# Altium project Control_Module_V1.PrjPcb
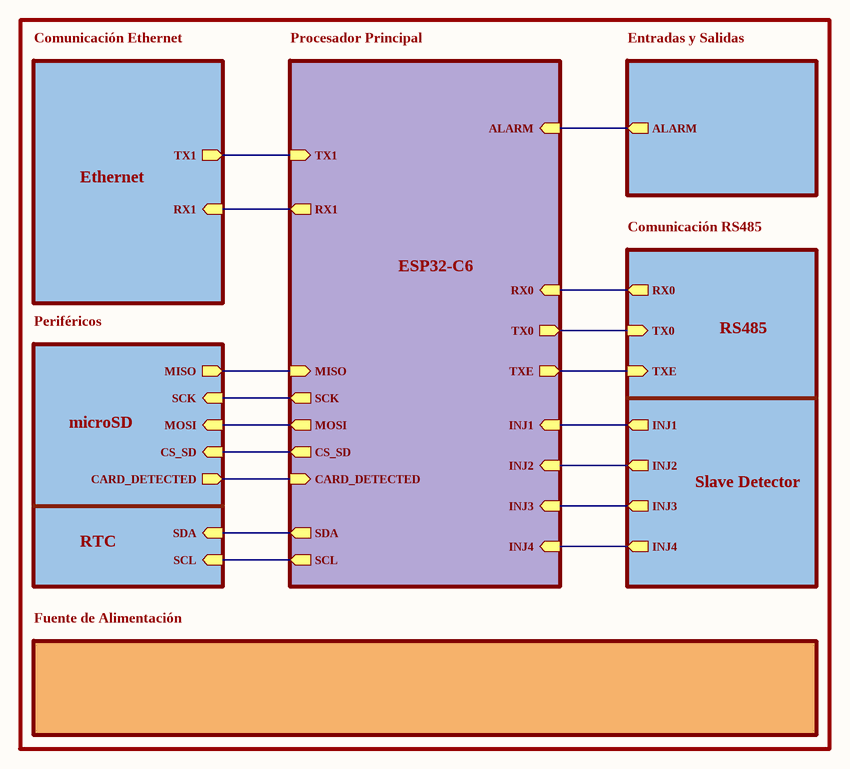
[diagram p0: Control_Module_MAIN.SchDoc]
7 sheets, 113 parts. Net scope: hierarchical (ports join the sheet entries above them; power ports are global).
Board files: Control_Module_PCB_V1.PcbDoc, Control_Module_Panel.PcbDoc
Sheets:
  Control_Module_MAIN.SchDoc
    Comunicación Ethernet = Control_Module_ETH.SchDoc
    Procesador Principal = Control_Module_CPU.SchDoc
    Comunicación RS485 = Control_Module_RS485.SchDoc
    Fuente de Alimentación = Control_Module_PSU.SchDoc
    Periféricos = Control_Module_PER.SchDoc
    Entradas y Salidas = Control_Module_IO.SchDoc

## Sheet Control_Module_MAIN.SchDoc: Módulo de Control - Vista General
size A4; Author: Martin C.A. Yunis; CompanyName: Sistema de Control de Acceso; Revision: V1; SheetNumber: 1; SheetTotal: 7

### Sub-sheets
Comunicación Ethernet = Control_Module_ETH: TX1 (out), RX1 (in)
Comunicación RS485 = Control_Module_RS485: RX0 (out), TX0 (in), TXE (in), INJ1 (out), INJ2 (out), INJ3 (out), INJ4 (out)
Entradas y Salidas = Control_Module_IO: ALARM (out)
Fuente de Alimentación = Control_Module_PSU: no entries
Periféricos = Control_Module_PER: MISO (out), SCK (in), MOSI (in), CS_SD (in), CARD_DETECTED (out), SDA (in), SCL (in)
Procesador Principal = Control_Module_CPU: MISO (in), SCK (out), MOSI (out), CS_SD (out), CARD_DETECTED (in), SDA (out), SCL (out), ALARM (in), RX1 (out), RX0 (in), TX0 (out), TXE (out), INJ1 (in), TX1 (in), INJ2 (in), INJ3 (in), INJ4 (in)

### Nets
CD: sheet Procesador Principal/CARD_DETECTED, sheet Periféricos/CARD_DETECTED
CS_SD: sheet Procesador Principal/CS_SD, sheet Periféricos/CS_SD
INJ1: sheet Procesador Principal/INJ1, sheet Comunicación RS485/INJ1
INJ2: sheet Procesador Principal/INJ2, sheet Comunicación RS485/INJ2
INJ3: sheet Procesador Principal/INJ3, sheet Comunicación RS485/INJ3
INJ4: sheet Procesador Principal/INJ4, sheet Comunicación RS485/INJ4
MISO: sheet Procesador Principal/MISO, sheet Periféricos/MISO
MOSI: sheet Procesador Principal/MOSI, sheet Periféricos/MOSI
RX0: sheet Procesador Principal/RX0, sheet Comunicación RS485/RX0
RX1: sheet Comunicación Ethernet/RX1, sheet Procesador Principal/RX1
SCK: sheet Procesador Principal/SCK, sheet Periféricos/SCK
SCL: sheet Procesador Principal/SCL, sheet Periféricos/SCL
SDA: sheet Procesador Principal/SDA, sheet Periféricos/SDA
TX0: sheet Procesador Principal/TX0, sheet Comunicación RS485/TX0
TX1: sheet Comunicación Ethernet/TX1, sheet Procesador Principal/TX1
TXE: sheet Procesador Principal/TXE, sheet Comunicación RS485/TXE
V_Alarm: sheet Procesador Principal/ALARM, sheet Entradas y Salidas/ALARM

### Notes on the sheet
- Ethernet
- ESP32-C6
- RS485
- microSD
- Slave Detector
- RTC
- Title:
- Size:
- Author:
- A4
- Sheet
- of
- Revision:
- File:
- Date:

## Sheet Control_Module_ETH.SchDoc: Módulo de Control - Ethernet
size A4; Author: Martin C.A. Yunis; CompanyName: Sistema de Control de Acceso; Revision: V1; SheetNumber: 2; SheetTotal: 7
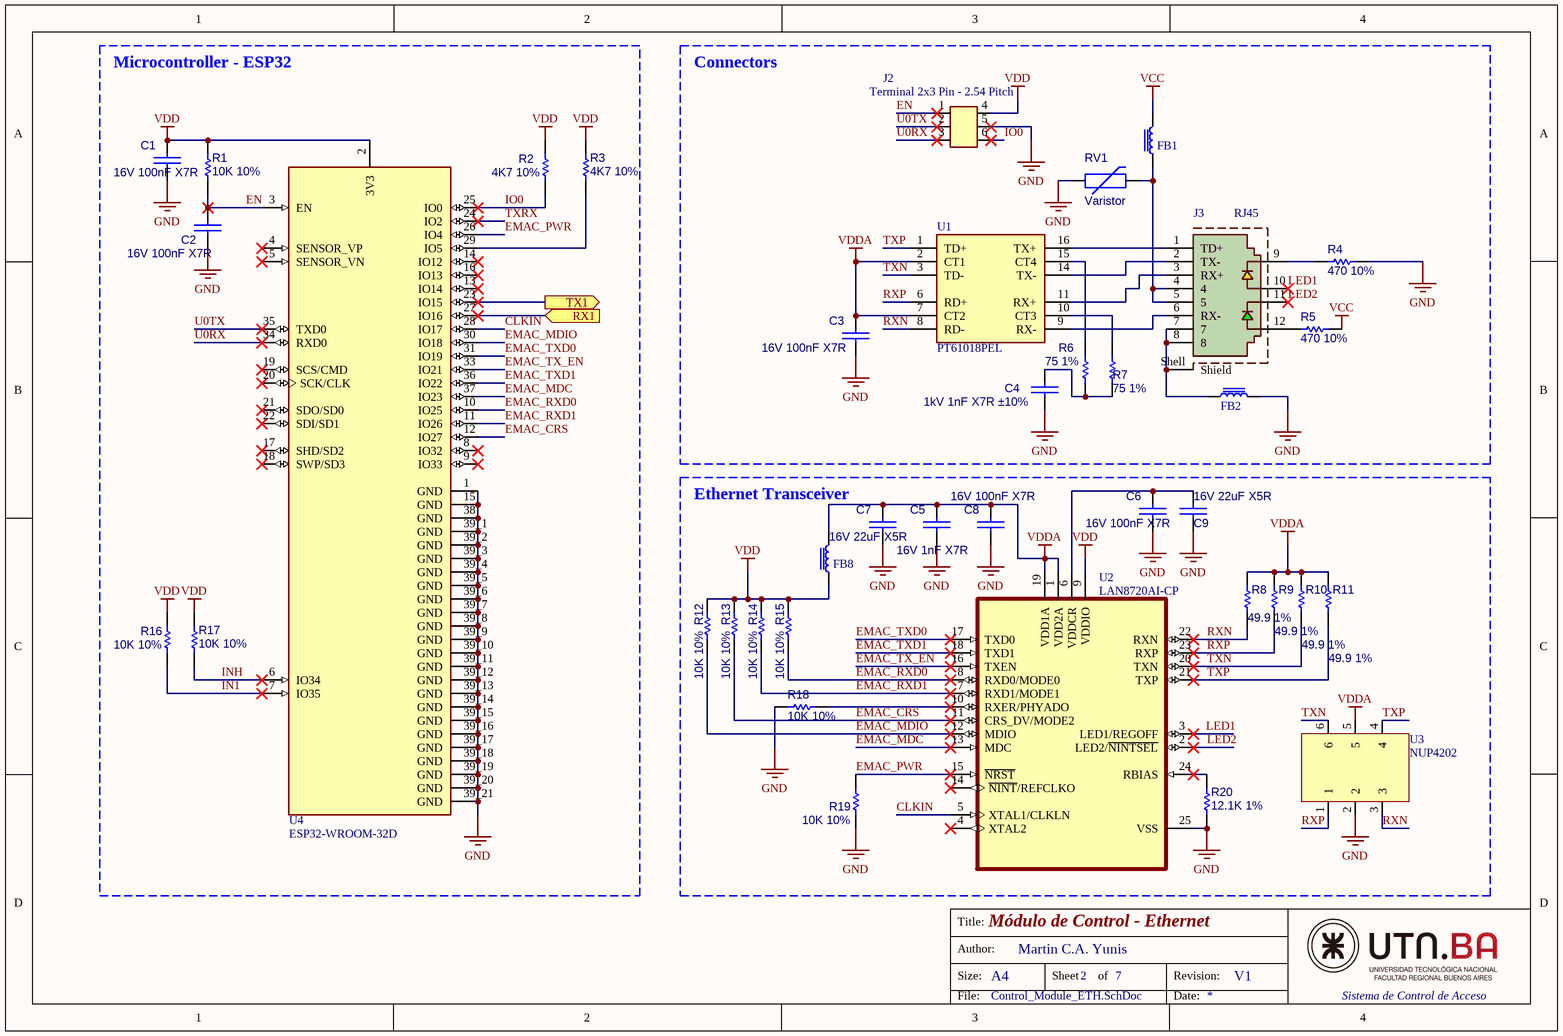
[diagram p1: Control_Module_ETH.SchDoc]

### Parts
C1  16V 100nF X7R  [CAP0402]
C2  16V 100nF X7R  [CAP0402]
C3  16V 100nF X7R  [CAP0402]
C4  1kV 1nF X7R ±10%  [CAP_1210]
C5  16V 1nF X7R  [CAP0402]
C6  16V 100nF X7R  [CAP0402]
C7  16V 22uF X5R  [CAP_1210]
C8  16V 100nF X7R  [CAP0402]
C9  16V 22uF X5R  [CAP_1210]
FB1  Choke 450mΩ ±25%  [CHOKE0603]  (value not drawn)
FB2  Choke 450mΩ ±25%  [CHOKE0603]  (value not drawn)
FB8  Choke  [CHOKE0603]  (value not drawn)
J2  Terminal 2x3 Pin - 2.54 Pitch  [2]
J3  RJ45  [TE_6116173-4]
R1  10K 10%  [RES0402]
R2  4K7 10%  [RES0402]
R3  4K7 10%  [RES0402]
R4  470 10%  [RES0402]
R5  470 10%  [RES0402]
R6  75 1%  [RES0402]
R7  75 1%  [RES0402]
R8  49.9 1%  [RES0402]
R9  49.9 1%  [RES0402]
R10  49.9 1%  [RES0402]
R11  49.9 1%  [RES0402]
R12  10K 10%  [RES0402]
R13  10K 10%  [RES0402]
R14  10K 10%  [RES0402]
R15  10K 10%  [RES0402]
R16  10K 10%  [RES0402]
R17  10K 10%  [RES0402]
R18  10K 10%  [RES0402]
R19  10K 10%  [RES0402]
R20  12.1K 1%  [RES0402]
RV1  Varistor  [RES0805]
U1  PT61018PEL  [XFMR_PT61018PEL]
U2  LAN8720AI-CP  [QFN50P400X400X100-25N]
U3  NUP4202  [SOT65P210X110-6N]
U4  ESP32-WROOM-32D  [XCVR_ESP32-WROOM-32U]

### Blocks framed on the sheet
Microcontroller - ESP32: C1 C2 R1-R3 R16 R17 U4
Connectors: C3 C4 FB1 FB2 J2 J3 R4-R7 RV1 U1
Ethernet Transceiver: C5-C9 FB8 R8-R15 R18-R20 U2 U3

### Ports
RX1 (in, see Control_Module_MAIN[2B], Control_Module_CPU[1B]), TX1 (out, see Control_Module_MAIN[2A], Control_Module_CPU[1C])

### Nets
GND: C1.2 C2.2 C3.2 C4.2 C5.2 C6.2 C7.2 C8.2 C9.2 FB2.2 J2.5 R4.2 R18.1 R19.2 R20.2 RV1.1 U2.25(VSS) U3.2 U4.1(GND) U4.15(GND) U4.38(GND) U4.39_1(GND) U4.39_2(GND) U4.39_3(GND) U4.39_4(GND) U4.39_5(GND) U4.39_6(GND) U4.39_7(GND) U4.39_8(GND) U4.39_9(GND) U4.39_10(GND) U4.39_11(GND) U4.39_12(GND) U4.39_13(GND) U4.39_14(GND) U4.39_15(GND) U4.39_16(GND) U4.39_17(GND) U4.39_18(GND) U4.39_19(GND) U4.39_20(GND) U4.39_21(GND)
VCC: FB1.2 R5.2
VDD: C1.1 FB8.1 J2.4 R1.1 R2.1 R3.1 R12.1 R13.1 R14.1 R15.1 R16.1 R17.1 U2.9(VDDIO) U4.2(3V3)
VDDA: C3.1 C5.1 C7.1 C8.1 FB8.2 R8.1 R9.1 R10.1 R11.1 U1.2(CT1) U1.7(CT2) U2.1(VDD2A) U2.19(VDD1A) U3.5
CLKIN: U2.5(XTAL1/CLKLN) U4.28(IO17)
EMAC_CRS: R13.2 U2.11(CRS_DV/MODE2) U4.12(IO27)
EMAC_MDC: U2.13(MDC) U4.37(IO23)
EMAC_MDIO: R12.2 U2.12(MDIO) U4.30(IO18)
EMAC_PWR: R19.1 U2.15(~{NRST}) U4.26(IO4)
EMAC_RXD0: R15.2 U2.8(RXD0/MODE0) U4.10(IO25)
EMAC_RXD1: R14.2 U2.7(RXD1/MODE1) U4.11(IO26)
EMAC_TX_EN: U2.16(TXEN) U4.33(IO21)
EMAC_TXD0: U2.17(TXD0) U4.31(IO19)
EMAC_TXD1: U2.18(TXD1) U4.36(IO22)
EN: C2.1 J2.1 R1.2 U4.3(EN)
IN1: R16.2 U4.7(IO35)
INH: R17.2 U4.6(IO34)
IO0: J2.6 R2.2 U4.25(IO0)
LED1: J3.10 U2.3(LED1/REGOFF)
LED2: J3.11 U2.2(LED2/~{NINTSEL})
RX1: U4.27(IO16) ; port RX1
RXN: R8.2 U1.8(RD-) U2.22(RXN) U3.3
RXP: R9.2 U1.6(RD+) U2.23(RXP) U3.1
TX1: U4.23(IO15) ; port TX1
TXN: R10.2 U1.3(TD-) U2.20(TXN) U3.6
TXP: R11.2 U1.1(TD+) U2.21(TXP) U3.4
TXRX: U4.24(IO2)
U0RX: J2.3 U4.34(RXD0)
U0TX: J2.2 U4.35(TXD0)
NetC4_1: C4.1 R6.2 R7.2
NetC6_1: C6.1 C9.1 U2.6(VDDCR)
NetFB1_1: FB1.1 J3.4 J3.5 RV1.2
NetFB2_1: FB2.1 J3.7 J3.8 J3.Shell(Shield)
NetJ3_1: J3.1(TD+) U1.16(TX+)
NetJ3_2: J3.2(TX-) U1.14(TX-)
NetJ3_3: J3.3(RX+) U1.11(RX+)
NetJ3_6: J3.6(RX-) U1.9(RX-)
NetJ3_9: J3.9 R4.1
NetJ3_12: J3.12 R5.1
NetR3_2: R3.2 U4.29(IO5)
NetR6_1: R6.1 U1.15(CT4)
NetR7_1: R7.1 U1.10(CT3)
NetR18_2: R18.2 U2.10(RXER/PHYADO)
NetR20_1: R20.1 U2.24(RBIAS)

Not connected (* = marked no-connect by the designer): U2 4(XTAL2)* 14(~{NINT}/REFCLKO)*; U4 4(SENSOR_VP)* 5(SENSOR_VN)* 8(IO32)* 9(IO33)* 13(IO14)* 14(IO12)* 16(IO13)* 17(SHD/SD2)* 18(SWP/SD3)* 19(SCS/CMD)* 20(SCK/CLK)* 21(SDO/SD0)* 22(SDI/SD1)*

### Notes on the sheet
- Title:
- Size:
- Author:
- A4
- Sheet
- of
- Revision:
- File:
- Date:

### Library data of the parts
C1-C3 C6 C8 = CAP: Non Polarized Capacitor; MANUF P/N: CL05B104KO5NNNC; JLCPCB P/N: C1525
C4 = CAP: Non Polarized Capacitor; MANUF P/N: C1210X102K102T; JLCPCB P/N: C106100
C5 = CAP: Non Polarized Capacitor; MANUF P/N: CC0402KRX7R7BB102; JLCPCB P/N: C189467
C7 C9 = CAP: Non Polarized Capacitor; MANUF P/N: CL32A226KOJNNNE; JLCPCB P/N: C19659
FB1 FB2 FB8 = Choke: High Frequency EMI Suppression Ferrite Bead; Manufacturer Part Number: 742863160; Manufacturer: Wurth Elektronik; MANUF P/N: GZ1608D601TF; Match Code: WE-CBF HF; Case/Size Code: 0603; DC Resistance: 0.22Ohm; Impedance @100MHz: 600Ohm; Impedance @1GHz: 800Ohm; Impedance Max: 950Ohm; Impedance Max Test Condition: 600MHz; Rated Current: 0.5A; Type: High Current; Category: Ferrites for PCB Assembly; ComponentLink1Description: Website Link; ComponentLink1URL: https://www.we-online.com/redexpert/article/742863160?ad; ComponentLink2Description: Datasheet Link; ComponentLink2URL: https://www.we-online.com/redexpert/spec/742863160?ad; Mount: Surface Mount; Operating Temperature Max: 125°C; Operating Temperature Min: -55°C; Packaging: Tape and Reel; Length: 1.6mm; Width: 0.8mm; Height: 0.8mm; JLCPCB P/N: C1002
J2 = CONN_3X2P: ESP32 Ethernet Programm Connector; MANUF P/N: 2.54-2*3PPin; JLCPCB P/N: C65114
J3 = CRJ061-L1-TH: 8P8C, Single Port, Vertical, Shielded, LED, Through Hole, RJ45 Modular Connector; MANUF P/N: HC-RJ45-5JA-1-1; MF: Same Sky; SnapEDA_Link: https://www.snapeda.com/parts/CRJ061-L1-TH/Same+Sky/view-part/?ref=snap; Package: None; Value: *; MP: CRJ061-L1-TH; Check_prices: https://www.snapeda.com/parts/CRJ061-L1-TH/Same+Sky/view-part/?ref=eda; JLCPCB P/N: C3000171
R1 R12-R19 = Res1: Resistor; MANUF P/N: CRCW040210K0FKED; JLCPCB P/N: C71617
R2 R3 = Res1: Resistor; MANUF P/N: CR0402FF4701G; JLCPCB P/N: C100444
R4 R5 = Res1: Resistor; MANUF P/N: CR0402FF4700G; JLCPCB P/N: C100443
R6 R7 = Res1: Resistor; MANUF P/N: CR0402JF0750G; JLCPCB P/N: C100685
R8-R11 = Res1: Resistor; MANUF P/N: RMC040249.91%N; JLCPCB P/N: C325388
R20 = Res1: Resistor; MANUF P/N: 0402WGF1212TCE; JLCPCB P/N: C25852
RV1 = VAR: MANUF P/N: AVR-M2012C220KT6AB; JLCPCB P/N: C432914
U1 = PT61018PEL: LAN Transformer, 10/100 Base-Tx, OP -40C to +85C, CUT TAPE | Bourns PT61018PEL; SnapEDA_Link: https://www.snapeda.com/parts/PT61018PEL/Bourns/view-part/?ref=snap; Package: SMD-16 Bourns; Value: *; MF: Bourns; MP: PT61018PEL; Check_prices: https://www.snapeda.com/parts/PT61018PEL/Bourns/view-part/?ref=eda; MANUF P/N: PT61018PEL; JLCPCB P/N: C840586
U2 = LAN8720A-CP: PHY 1-CH 10Mbps/100Mbps 2.5V/3.3V 24-Pin VQFN EP Tray; MF: Microchip Technology; SnapEDA_Link: https://www.snapeda.com/parts/LAN8720A-CP/Microchip/view-part/?ref=snap; Package: VFQFN-24 Microchip Technology; Value: *; MP: LAN8720AI-CP; Check_prices: https://www.snapeda.com/parts/LAN8720A-CP/Microchip/view-part/?ref=eda; MANUF P/N: LAN8720AI-CP; JLCPCB P/N: C633282
U3 = NUP4202: 6A 20V 6V Unidirectional 5V SOT-363 ESD and Surge Protection; MANUF P/N: NUP4202W1T2G; JLCPCB P/N: C21713972
U4 = ESP32-WROOM-32D: Bluetooth, WiFi 802.11b/g/n, Bluetooth v4.2 +EDR, Class 1, 2 and 3 Transceiver Module 2.4GHz ~ 2.5GHz Integrated; MANUF P/N: ESP32-WROOM-32U-N4; MF: Espressif Systems; SnapEDA_Link: https://www.snapeda.com/parts/ESP32-WROOM-32D/Espressif+Systems/view-part/?ref=snap; Package: Non Standard Espressif Systems; Value: *; MP: ESP32-WROOM-32D; Check_prices: https://www.snapeda.com/parts/ESP32-WROOM-32D/Espressif+Systems/view-part/?ref=eda; JLCPCB P/N: C328062

## Sheet Control_Module_CPU.SchDoc: Módulo de Control - CPU Principal
size A4; Author: Martin C.A. Yunis; CompanyName: Sistema de Control de Acceso; Revision: V1; SheetNumber: 3; SheetTotal: 7
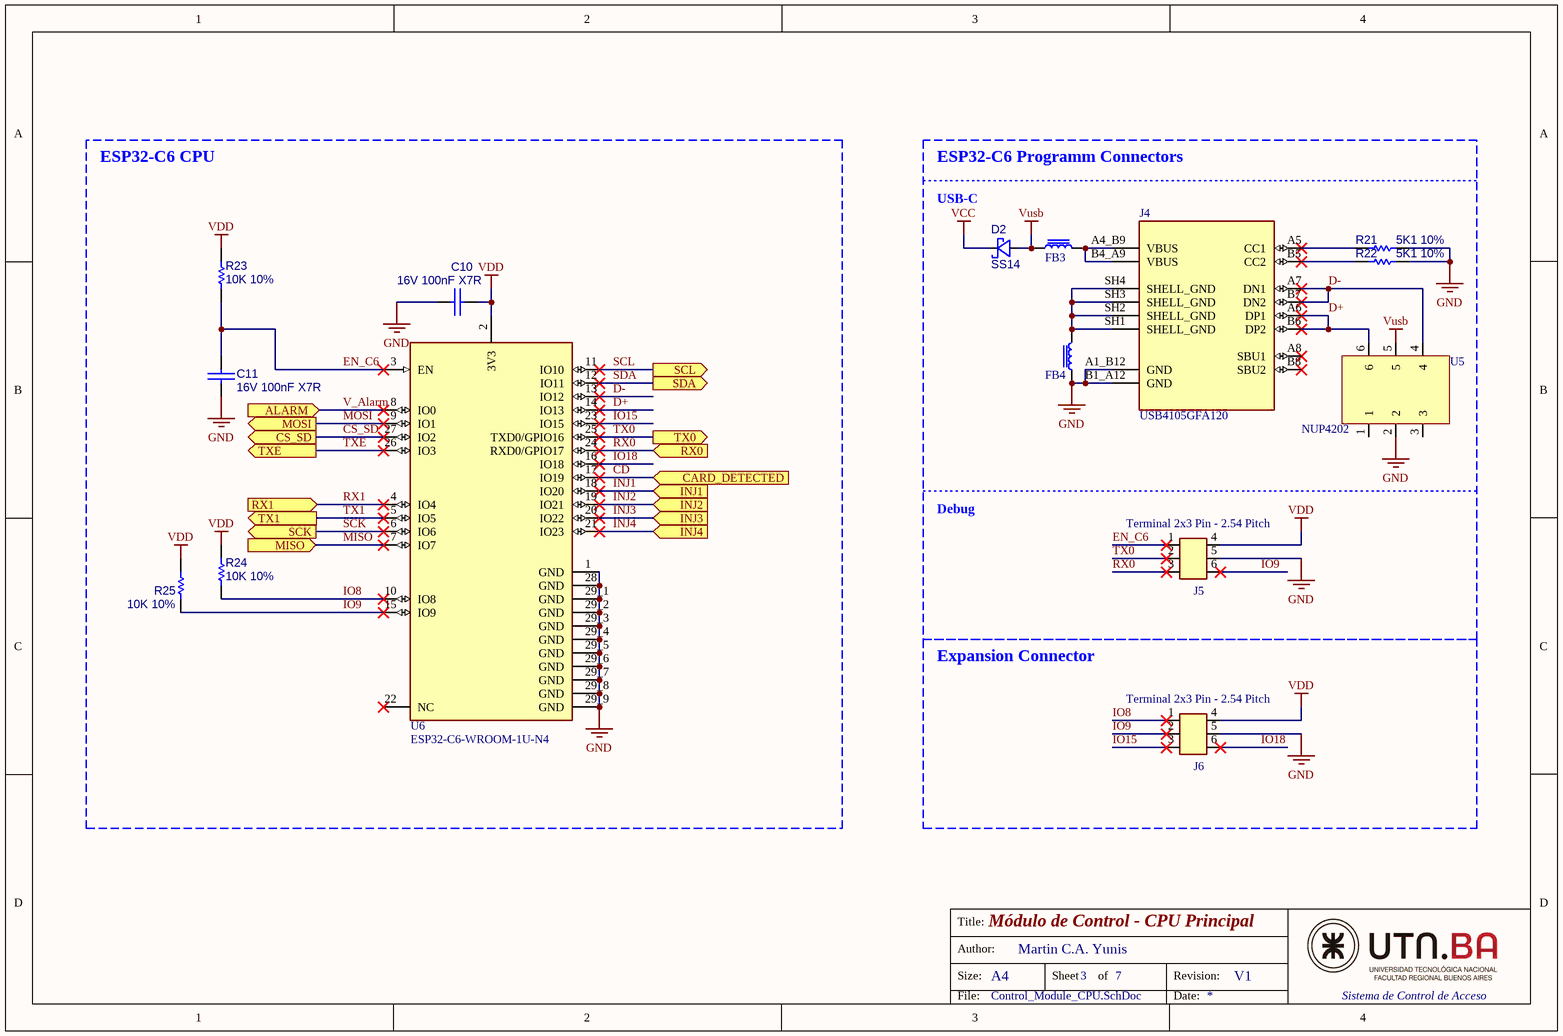
[diagram p2: Control_Module_CPU.SchDoc]

### Parts
C10  16V 100nF X7R  [CAP0402]
C11  16V 100nF X7R  [CAP0402]
D2  SS14  [D_SMA]
FB3  Choke 450mΩ ±25%  [CHOKE0603]  (value not drawn)
FB4  Choke 450mΩ ±25%  [CHOKE0603]  (value not drawn)
J4  USB4105GFA120  [GCT_USB4105GFA120]
J5  Terminal 2x3 Pin - 2.54 Pitch  [2]
J6  Terminal 2x3 Pin - 2.54 Pitch  [2]
R21  5K1 10%  [RES0402]
R22  5K1 10%  [RES0402]
R23  10K 10%  [RES0402]
R24  10K 10%  [RES0402]
R25  10K 10%  [RES0402]
U5  NUP4202  [SOT65P210X110-6N]
U6  ESP32-C6-WROOM-1U-N4  [XCVR_ESP32-C6-WROOM-1-N8]

### Blocks framed on the sheet
ESP32-C6 CPU: C10 C11 R23-R25 U6
ESP32-C6 Programm Connectors: D2 FB3 FB4 J4 J5 R21 R22 U5
Expansion Connector: J6

### Ports
ALARM (in, see Control_Module_MAIN[3A], Control_Module_IO[2B]), CARD_DETECTED (in, see Control_Module_MAIN[2C], Control_Module_PER[2B]), CS_SD (out, see Control_Module_MAIN[2C], Control_Module_PER[3B]), INJ1 (in, see Control_Module_MAIN[3C], Control_Module_RS485[1C]), INJ2 (in, see Control_Module_MAIN[3C], Control_Module_RS485[2C]), INJ3 (in, see Control_Module_MAIN[3C], Control_Module_RS485[1C]), INJ4 (in, see Control_Module_MAIN[3C], Control_Module_RS485[2C]), MISO (in, see Control_Module_MAIN[2B], Control_Module_PER[3B]), MOSI (out, see Control_Module_MAIN[2C], Control_Module_PER[3B]), RX0 (in, see Control_Module_MAIN[3B], Control_Module_RS485[1A]), RX1 (in, see Control_Module_MAIN[2B], Control_Module_ETH[2B]), SCK (out, see Control_Module_MAIN[2B], Control_Module_PER[3B]), SCL (out, see Control_Module_MAIN[2C], Control_Module_PER[2C]), SDA (out, see Control_Module_MAIN[2C], Control_Module_PER[2C]), TX0 (out, see Control_Module_MAIN[3B], Control_Module_RS485[1B]), TX1 (out, see Control_Module_MAIN[2A], Control_Module_ETH[2B]), TXE (out, see Control_Module_MAIN[3B], Control_Module_RS485[1B])

### Nets
GND: C10.1 C11.2 FB4.1 J4.A1_B12(GND) J4.B1_A12(GND) J5.5 J6.5 R21.2 R22.2 U5.2 U6.1(GND) U6.28(GND) U6.29_1(GND) U6.29_2(GND) U6.29_3(GND) U6.29_4(GND) U6.29_5(GND) U6.29_6(GND) U6.29_7(GND) U6.29_8(GND) U6.29_9(GND)
VCC: D2.2(K)
VDD: C10.2 J5.4 J6.4 R23.1 R24.1 R25.1 U6.2(3V3)
Vusb: D2.1(A) FB3.1 U5.5
CD: U6.17(IO19) ; port CARD_DETECTED
CS_SD: U6.27(IO2) ; port CS_SD
D+: J4.A6(DP1) J4.B6(DP2) U5.6 U6.14(IO13)
D-: J4.A7(DN1) J4.B7(DN2) U5.4 U6.13(IO12)
EN_C6: C11.1 J5.1 R23.2 U6.3(EN)
INJ1: U6.18(IO20) ; port INJ1
INJ2: U6.19(IO21) ; port INJ2
INJ3: U6.20(IO22) ; port INJ3
INJ4: U6.21(IO23) ; port INJ4
IO8: J6.1 R24.2 U6.10(IO8)
IO9: J5.6 J6.2 R25.2 U6.15(IO9)
IO15: J6.3 U6.23(IO15)
IO18: J6.6 U6.16(IO18)
MISO: U6.7(IO7) ; port MISO
MOSI: U6.9(IO1) ; port MOSI
RX0: J5.3 U6.24(RXD0/GPIO17) ; port RX0
RX1: U6.4(IO4) ; port RX1
SCK: U6.6(IO6) ; port SCK
SCL: U6.11(IO10) ; port SCL
SDA: U6.12(IO11) ; port SDA
TX0: J5.2 U6.25(TXD0/GPIO16) ; port TX0
TX1: U6.5(IO5) ; port TX1
TXE: U6.26(IO3) ; port TXE
V_Alarm: U6.8(IO0) ; port ALARM
NetFB3_2: FB3.2 J4.A4_B9(VBUS) J4.B4_A9(VBUS)
NetFB4_2: FB4.2 J4.SH1(SHELL_GND) J4.SH2(SHELL_GND) J4.SH3(SHELL_GND) J4.SH4(SHELL_GND)
NetJ4_A5: J4.A5(CC1) R21.1
NetJ4_B5: J4.B5(CC2) R22.1

Not connected (* = marked no-connect by the designer): J4 A8(SBU1)* B8(SBU2)*; U5 1 3; U6 22(NC)*

### Notes on the sheet
- (near D2) USB-C
- Debug
- Title:
- Size:
- Author:
- A4
- Sheet
- of
- Revision:
- File:
- Date:

### Library data of the parts
C10 C11 = CAP: as C1 on sheet Control_Module_ETH; JLCPCB P/N: C1525
D2 = DIODO_SH: Diode Shottky; MANUF P/N: SS14; JLCPCB P/N: C2480
FB3 FB4 = Choke: as FB1 on sheet Control_Module_ETH; Category: Ferrites for PCB Assembly; ComponentLink1Description: Website Link; ComponentLink1URL: https://www.we-online.com/redexpert/article/742863160?ad; ComponentLink2Description: Datasheet Link; ComponentLink2URL: https://www.we-online.com/redexpert/spec/742863160?ad; Mount: Surface Mount; Operating Temperature Max: 125°C; Operating Temperature Min: -55°C; Packaging: Tape and Reel; Length: 1.6mm; Width: 0.8mm; Height: 0.8mm; JLCPCB P/N: C1002
J4 = USB4105GFA120: USB CONN, 2.0 TYPE C, RCPT, 16POS, SMT; USB Connector Type:USB Type C; USB Standard:USB 2.0; Gender:Receptacle; No. of Positions:16Positions; Connector Mounting:Surface Mount, Through Hole Mount; Orientation:Right Angle RoHS Compliant: Yes; MANUF P/N: USB4105-GF-A-060; MF: Global Connector Technology; SnapEDA_Link: https://www.snapeda.com/parts/USB4105GFA120/Global+Connector+Technology/view-part/?ref=snap; Package: None; Value: *; Check_prices: https://www.snapeda.com/parts/USB4105GFA120/Global+Connector+Technology/view-part/?ref=eda; JLCPCB P/N: C3025063
J5 = CONN_3X2P: ESP32-C6 Debug Connector; MANUF P/N: 2.54-2*3PPin; JLCPCB P/N: C65114
J6 = CONN_3X2P: ESP32-C6 Expansion Connector; MANUF P/N: 2.54-2*3PPin; JLCPCB P/N: C65114
R21 R22 = Res1: Resistor; MANUF P/N: CR0402JF0512G; JLCPCB P/N: C100665
R23-R25 = Res1: Resistor; MANUF P/N: CRCW040210K0FKED; JLCPCB P/N: C71617
U5 = NUP4202: as U3 on sheet Control_Module_ETH; JLCPCB P/N: C21713972
U6 = ESP32-C6-WROOM-1U-N4: 802.15.4, Bluetooth, WiFi 802.11ax, Bluetooth v5.3, ZigbeeÂ® Transceiver Module 2.4GHz Antenna Not Included, U.FL Surface Mount; MANUF P/N: ESP32-C6-WROOM-1-N8; MF: Espressif Systems; SnapEDA_Link: https://www.snapeda.com/parts/ESP32-C6-WROOM-1U-N4/Espressif+Systems/view-part/?ref=snap; Package: SMD-37 Espressif Systems; Value: *; MP: ESP32-C6-WROOM-1U-N4; Check_prices: https://www.snapeda.com/parts/ESP32-C6-WROOM-1U-N4/Espressif+Systems/view-part/?ref=eda; JLCPCB P/N: C5366877

## Sheet Control_Module_RS485.SchDoc: Módulo de Control - Conexión RS485
size A4; Author: Martin C.A. Yunis; CompanyName: Sistema de Control de Acceso; Revision: V1; SheetNumber: 4; SheetTotal: 7
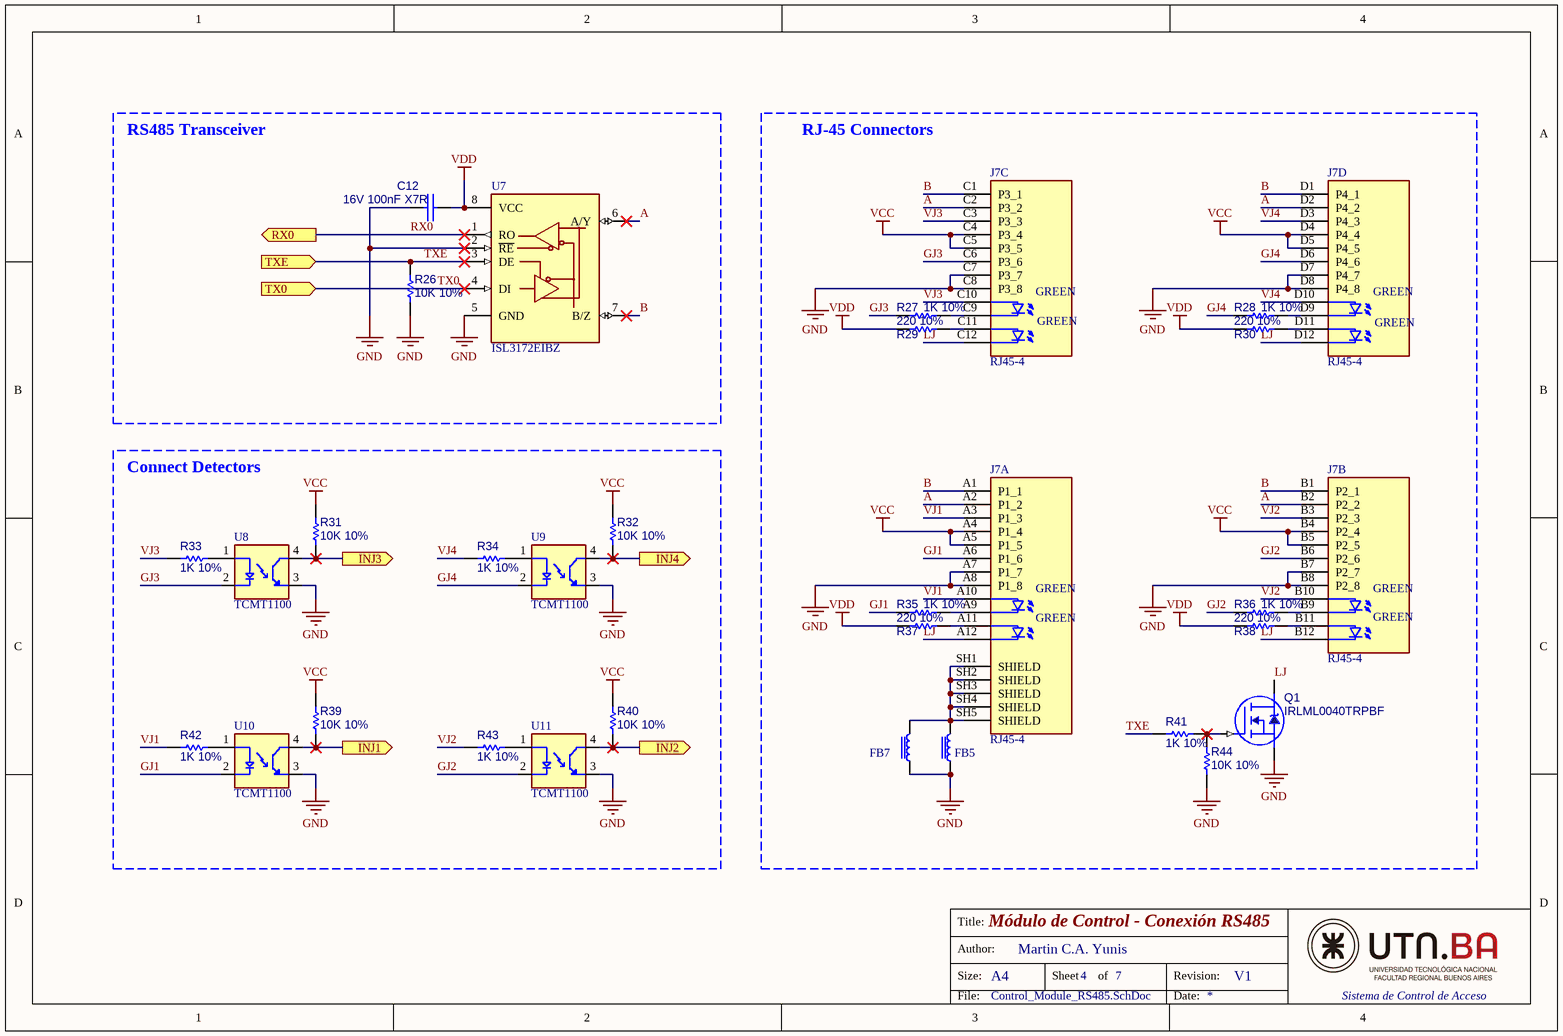
[diagram p3: Control_Module_RS485.SchDoc]

### Parts
C12  16V 100nF X7R  [CAP0402]
FB5  Choke 450mΩ ±25%  [CHOKE0603]  (value not drawn)
FB7  Choke 450mΩ ±25%  [CHOKE0603]  (value not drawn)
J7  RJ45-4  [615032137921]  (parts A,B,C,D of 4)
Q1  IRLML0040TRPBF  [SOT_23]
R26  10K 10%  [RES0402]
R27  1K 10%  [RES0402]
R28  1K 10%  [RES0402]
R29  220 10%  [RES0402]
R30  220 10%  [RES0402]
R31  10K 10%  [RES0402]
R32  10K 10%  [RES0402]
R33  1K 10%  [RES0402]
R34  1K 10%  [RES0402]
R35  1K 10%  [RES0402]
R36  1K 10%  [RES0402]
R37  220 10%  [RES0402]
R38  220 10%  [RES0402]
R39  10K 10%  [RES0402]
R40  10K 10%  [RES0402]
R41  1K 10%  [RES0402]
R42  1K 10%  [RES0402]
R43  1K 10%  [RES0402]
R44  10K 10%  [RES0402]
U7  ISL3172EIBZ  [SOIC127P600X175-8N]
U8  TCMT1100  [SOIC127P700X230-4N]
U9  TCMT1100  [SOIC127P700X230-4N]
U10  TCMT1100  [SOIC127P700X230-4N]
U11  TCMT1100  [SOIC127P700X230-4N]

### Blocks framed on the sheet
RS485 Transceiver: C12 R26 U7
RJ-45 Connectors: FB5 FB7 J7 Q1 R27-R30 R35-R38 R41 R44
Connect Detectors: R31-R34 R39 R40 R42 R43 U8-U11

### Ports
INJ1 (out, see Control_Module_MAIN[3C], Control_Module_CPU[2B]), INJ2 (out, see Control_Module_MAIN[3C], Control_Module_CPU[2B]), INJ3 (out, see Control_Module_MAIN[3C], Control_Module_CPU[2C]), INJ4 (out, see Control_Module_MAIN[3C], Control_Module_CPU[2C]), RX0 (out, see Control_Module_MAIN[3B], Control_Module_CPU[2B]), TX0 (in, see Control_Module_MAIN[3B], Control_Module_CPU[2B]), TXE (in, see Control_Module_MAIN[3B], Control_Module_CPU[1B])

### Nets
GND: C12.1 FB5.1 FB7.1 J7.A7(P1_7) J7.A8(P1_8) J7.B7(P2_7) J7.B8(P2_8) J7.C7(P3_7) J7.C8(P3_8) J7.D7(P4_7) J7.D8(P4_8) Q1.2(SOURCE) R26.2 R44.2 U7.2(~{RE}) U7.5(GND) U8.3(ET) U9.3(ET) U10.3(ET) U11.3(ET)
VCC: J7.A4(P1_4) J7.A5(P1_5) J7.B4(P2_4) J7.B5(P2_5) J7.C4(P3_4) J7.C5(P3_5) J7.D4(P4_4) J7.D5(P4_5) R31.1 R32.1 R39.1 R40.1
VDD: C12.2 R29.1 R30.1 R37.1 R38.1 U7.8(VCC)
A: J7.A2(P1_2) J7.B2(P2_2) J7.C2(P3_2) J7.D2(P4_2) U7.6(A/Y)
B: J7.A1(P1_1) J7.B1(P2_1) J7.C1(P3_1) J7.D1(P4_1) U7.7(B/Z)
GJ1: J7.A6(P1_6) R35.1 U10.2(C)
GJ2: J7.B6(P2_6) R36.1 U11.2(C)
GJ3: J7.C6(P3_6) R27.1 U8.2(C)
GJ4: J7.D6(P4_6) R28.1 U9.2(C)
INJ1: R39.2 U10.4(CT) ; port INJ1
INJ2: R40.2 U11.4(CT) ; port INJ2
INJ3: R31.2 U8.4(CT) ; port INJ3
INJ4: R32.2 U9.4(CT) ; port INJ4
LJ: J7.A12(P1_CATHODE_GRN2) J7.B12(P2_CATHODE_GRN2) J7.C12(P3_CATHODE_GRN2) J7.D12(P4_CATHODE_GRN2) Q1.3(DRAIN)
RX0: U7.1(RO) ; port RX0
TX0: U7.4(DI) ; port TX0
TXE: R26.1 R41.1 U7.3(DE) ; port TXE
VJ1: J7.A3(P1_3) J7.A10(P1_ANODE_GRN1) R42.1
VJ2: J7.B3(P2_3) J7.B10(P2_ANODE_GRN1) R43.1
VJ3: J7.C3(P3_3) J7.C10(P3_ANODE_GRN1) R33.1
VJ4: J7.D3(P4_3) J7.D10(P4_ANODE_GRN1) R34.1
NetFB5_2: FB5.2 FB7.2 J7.SH1(SHIELD) J7.SH2(SHIELD) J7.SH3(SHIELD) J7.SH4(SHIELD) J7.SH5(SHIELD)
NetJ7_A9: J7.A9(P1_CATHODE_GRN1) R35.2
NetJ7_A11: J7.A11(P1_ANODE_GRN2) R37.2
NetJ7_B9: J7.B9(P2_CATHODE_GRN1) R36.2
NetJ7_B11: J7.B11(P2_ANODE_GRN2) R38.2
NetJ7_C9: J7.C9(P3_CATHODE_GRN1) R27.2
NetJ7_C11: J7.C11(P3_ANODE_GRN2) R29.2
NetJ7_D9: J7.D9(P4_CATHODE_GRN1) R28.2
NetJ7_D11: J7.D11(P4_ANODE_GRN2) R30.2
NetQ1_1: Q1.1(GATE) R41.2 R44.1
NetR33_2: R33.2 U8.1(A)
NetR34_2: R34.2 U9.1(A)
NetR42_2: R42.2 U10.1(A)
NetR43_2: R43.2 U11.1(A)

### Notes on the sheet
- Title:
- Size:
- Author:
- A4
- Sheet
- of
- Revision:
- File:
- Date:
- (in symbol RJ45-4, part A) GREEN
- (in symbol RJ45-4, part B) GREEN
- (in symbol RJ45-4, part C) GREEN
- (in symbol RJ45-4, part D) GREEN

### Library data of the parts
C12 = CAP: as C1 on sheet Control_Module_ETH; JLCPCB P/N: C1525
FB5 FB7 = Choke: High Frequency EMI Suppression Ferrite Bead; Manufacturer Part Number: 742863160; Manufacturer: Wurth Elektronik; Match Code: WE-CBF HF; Case/Size Code: 0603; DC Resistance: 0.22Ohm; Impedance @100MHz: 600Ohm; Impedance @1GHz: 800Ohm; Impedance Max: 950Ohm; Impedance Max Test Condition: 600MHz; Rated Current: 0.5A; Type: High Current; Category: Ferrites for PCB Assembly; ComponentLink1Description: Website Link; ComponentLink1URL: https://www.we-online.com/redexpert/article/742863160?ad; ComponentLink2Description: Datasheet Link; ComponentLink2URL: https://www.we-online.com/redexpert/spec/742863160?ad; Mount: Surface Mount; Operating Temperature Max: 125°C; Operating Temperature Min: -55°C; Packaging: Tape and Reel; Length: 1.6mm; Width: 0.8mm; Height: 0.8mm
J7 = RJ45-4: Quadruple RJ-45 Connector; MANUF P/N: HC-RJ45-5JA-4-2; MP: 1888251-4; Package: None; Price: None; Value: *; Availability: Unavailable; JLCPCB P/N: C3000183
Q1 = N_MOSFET_SOT23: Mosfet N-Ch; MANUF P/N: IRLML0040TRPBF; JLCPCB P/N: C67273
R26 R31 R32 R39 R40 R44 = Res1: Resistor; MANUF P/N: CRCW040210K0FKED; JLCPCB P/N: C71617
R27 R28 R33-R36 R41-R43 = Res1: Resistor; MANUF P/N: CRCW04021K00FKED; JLCPCB P/N: C71623
R29 R30 R37 R38 = Res1: Resistor; MANUF P/N: CR0402FF2200G; JLCPCB P/N: C100308
U7 = ISL3172EIBZ: 1/1 Transceiver Half RS422, RS485 8-SOIC; MF: Renesas Electronics America Inc; SnapEDA_Link: https://www.snapeda.com/parts/ISL3172EIBZ/Renesas/view-part/?ref=snap; Package: SOIC-8 Renesas; Value: *; MP: ISL3172EIBZ; Check_prices: https://www.snapeda.com/parts/ISL3172EIBZ/Renesas/view-part/?ref=eda; MANUF P/N: ISL3172EIBZ; JLCPCB P/N: C5772578
U8-U11 = TCMT1100: Optoisolator Transistor Output 3750Vrms 1 Channel 4-SOP; MF: Vishay Semiconductor; SnapEDA_Link: https://www.snapeda.com/parts/TCMT1100/Vishay/view-part/?ref=snap; Package: SOP-4 Vishay Semiconductor; Value: *; MP: TCMT1100; Check_prices: https://www.snapeda.com/parts/TCMT1100/Vishay/view-part/?ref=eda; MANUF P/N: TCMT1100; JLCPCB P/N: C118298

## Sheet Control_Module_PSU.SchDoc: Módulo de Control - Power Supply
size A4; Author: Martin C.A. Yunis; CompanyName: Sistema de Control de Acceso; Revision: V1; SheetNumber: 5; SheetTotal: 7
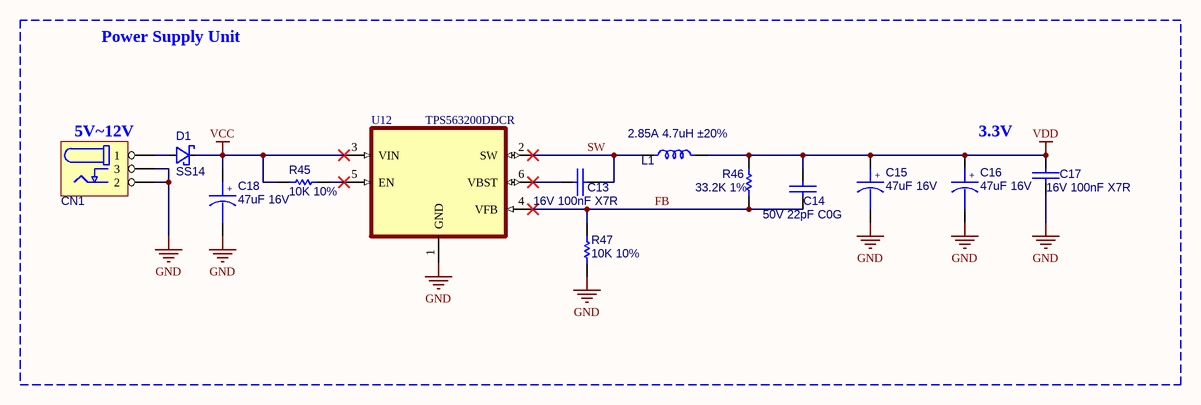
[diagram p4: Control_Module_PSU.SchDoc]

### Parts
C13  16V 100nF X7R  [CAP0402]
C14  50V 22pF C0G  [CAP0402]
C15  47uF 16V  [CAP_P1210]
C16  47uF 16V  [CAP_P1210]
C17  16V 100nF X7R  [CAP0402]
C18  47uF 16V  [CAP_P1210]
CN1  CN_PowerJack  [PJ002B]  (value not drawn)
D1  SS14  [D_SMA]
L1  2.85A 4.7uH ±20%  [ind1515]
R45  10K 10%  [RES0402]
R46  33.2K 1%  [RES0402]
R47  10K 10%  [RES0402]
U12  TPS563200DDCR  [SOT95P280X110-6N]

### Nets
GND: C15.2 C16.2 C17.2 C18.2 CN1.2 CN1.3 R47.2 U12.1(GND)
VCC: C18.1 D1.2(K) R45.1 U12.3(VIN)
VDD: C14.2 C15.1 C16.1 C17.1 L1.2 R46.2
FB: C14.1 R46.1 R47.1 U12.4(VFB)
SW: C13.2 L1.1 U12.2(SW)
NetC13_1: C13.1 U12.6(VBST)
NetCN1_1: CN1.1 D1.1(A)
NetR45_2: R45.2 U12.5(EN)

### Notes on the sheet
- Power Supply Unit
- (near CN1) 5V~12V
- 3.3V
- Title:
- Size:
- Author:
- A4
- Sheet
- of
- Revision:
- File:
- Date:
- (in symbol CAP_P) +

### Library data of the parts
C13 C17 = CAP: as C1 on sheet Control_Module_ETH; JLCPCB P/N: C1525
C14 = CAP: Non Polarized Capacitor; MANUF P/N: CL05C220JB5NNNC; JLCPCB P/N: C70464
C15 C16 C18 = CAP_P: Polarized Tantalum Capacitor; MANUF P/N: CA45-B-16V-47uF-K; JLCPCB P/N: C136751
CN1 = CN_PowerJack: Barrel Power Connector; MANUF P/N: PJ-002BH; JLCPCB P/N: C22359705
D1 = DIODO_SH: Diode Shottky; MANUF P/N: SS14; JLCPCB P/N: C2480
L1 = IND: Power Inductor; MANUF P/N: WPN4020H4R7MT; JLCPCB P/N: C98363
R45 R47 = Res1: Resistor; MANUF P/N: CRCW040210K0FKED; JLCPCB P/N: C71617
R46 = Res1: Resistor; MANUF P/N: RC0402FR-0733K2L; JLCPCB P/N: C130276
U12 = TPS563200DDCR: 17 V Input, 3A Synchronous Step-Down Regulator in SOT-23 with Advanced Eco-modeâ„¢; MF: Texas Instruments; SnapEDA_Link: https://www.snapeda.com/parts/TPS563200DDCR/Texas+Instruments/view-part/?ref=snap; Package: SOT-23-THN-6 Texas Instruments; Value: *; MP: TPS563200DDCR; Check_prices: https://www.snapeda.com/parts/TPS563200DDCR/Texas+Instruments/view-part/?ref=eda; MANUF P/N: TPS563200DDCR; JLCPCB P/N: C97253

## Sheet Control_Module_PER.SchDoc: Módulo de Control - Periféricos
size A4; Author: Martin C.A. Yunis; CompanyName: Sistema de Control de Acceso; Revision: V1; SheetNumber: 6; SheetTotal: 7
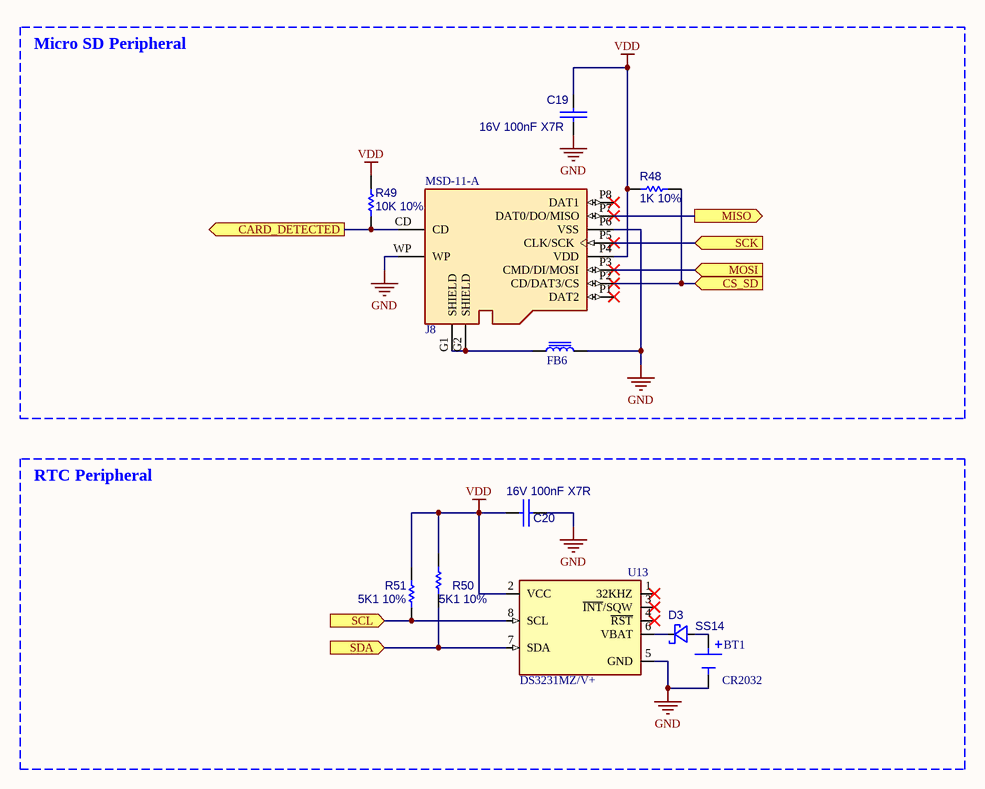
[diagram p5: Control_Module_PER.SchDoc]

### Parts
BT1  CR2032  [KEYSTONE_1063TR_1063TR]
C19  16V 100nF X7R  [CAP0402]
C20  16V 100nF X7R  [CAP0402]
D3  SS14  [D_SMA]
FB6  Choke 450mΩ ±25%  [CHOKE0603]  (value not drawn)
J8  MSD-11-A  [CUI_MSD-11-A]
R48  1K 10%  [RES0402]
R49  10K 10%  [RES0402]
R50  5K1 10%  [RES0402]
R51  5K1 10%  [RES0402]
U13  DS3231MZ/V+  [21-0041B_8]

### Blocks framed on the sheet
Micro SD Peripheral: C19 FB6 J8 R48 R49
RTC Peripheral: BT1 C20 D3 R50 R51 U13

### Ports
CARD_DETECTED (out, see Control_Module_MAIN[2C], Control_Module_CPU[2B]), CS_SD (in, see Control_Module_MAIN[2C], Control_Module_CPU[1B]), MISO (out, see Control_Module_MAIN[2B], Control_Module_CPU[1C]), MOSI (in, see Control_Module_MAIN[2C], Control_Module_CPU[1B]), SCK (in, see Control_Module_MAIN[2B], Control_Module_CPU[1C]), SCL (in, see Control_Module_MAIN[2C], Control_Module_CPU[2B]), SDA (in, see Control_Module_MAIN[2C], Control_Module_CPU[2B])

### Nets
GND: BT1.N C19.2 C20.2 FB6.2 J8.P6(VSS) J8.WP U13.5(GND)
VDD: C19.1 C20.1 J8.P4(VDD) R48.1 R49.1 R50.1 R51.1 U13.2(VCC)
CD: J8.CD R49.2 ; port CARD_DETECTED
CS_SD: J8.P2(CD/DAT3/CS) R48.2 ; port CS_SD
MISO: J8.P7(DAT0/DO/MISO) ; port MISO
MOSI: J8.P3(CMD/DI/MOSI) ; port MOSI
SCK: J8.P5(CLK/SCK) ; port SCK
SCL: R51.2 U13.8(SCL) ; port SCL
SDA: R50.2 U13.7(SDA) ; port SDA
NetBT1_P: BT1.P D3.1(A)
NetD3_2: D3.2(K) U13.6(VBAT)
NetFB6_1: FB6.1 J8.G1(SHIELD) J8.G2(SHIELD)

Not connected (* = marked no-connect by the designer): J8 P1(DAT2)* P8(DAT1)*; U13 1(32KHZ)* 3(~{INT}/SQW)* 4(~{RST})*

### Notes on the sheet
- Title:
- Size:
- Author:
- A4
- Sheet
- of
- Revision:
- File:
- Date:

### Library data of the parts
BT1 = BAT-HLD-011-THM: Battery Holder Coin 20 SMT Nickel T&R; MANUF P/N: BS-06-B4BK006; MF: TE Connectivity; SnapEDA_Link: https://www.snapeda.com/parts/BAT-HLD-011-THM/TE+Connectivity/view-part/?ref=snap; Package: None; Value: *; MP: BAT-HLD-011-THM; Check_prices: https://www.snapeda.com/parts/BAT-HLD-011-THM/TE+Connectivity/view-part/?ref=eda; JLCPCB P/N: C964764
C19 C20 = CAP: as C1 on sheet Control_Module_ETH; JLCPCB P/N: C1525
D3 = DIODO_SH: Diode Shottky; MANUF P/N: SS14; JLCPCB P/N: C2480
FB6 = Choke: as FB1 on sheet Control_Module_ETH; Category: Ferrites for PCB Assembly; ComponentLink1Description: Website Link; ComponentLink1URL: https://www.we-online.com/redexpert/article/742863160?ad; ComponentLink2Description: Datasheet Link; ComponentLink2URL: https://www.we-online.com/redexpert/spec/742863160?ad; Mount: Surface Mount; Operating Temperature Max: 125°C; Operating Temperature Min: -55°C; Packaging: Tape and Reel; Length: 1.6mm; Width: 0.8mm; Height: 0.8mm; JLCPCB P/N: C1002
J8 = MSD-11-A: Micro SD Card Connector, 8 Positions, Connector and Ejector, Push In, Auto Eject Out, Surface Mount, 1.85 mm Heaight Above Board, Gold Flash; MANUF P/N: SD-01A; MF: Same Sky; SnapEDA_Link: https://www.snapeda.com/parts/MSD-11-A/Same+Sky/view-part/?ref=snap; Package: None; Value: *; MP: MSD-11-A; Check_prices: https://www.snapeda.com/parts/MSD-11-A/Same+Sky/view-part/?ref=eda; JLCPCB P/N: C693845
R48 = Res1: Resistor; MANUF P/N: CRCW04021K00FKED; JLCPCB P/N: C71623
R49 = Res1: Resistor; MANUF P/N: CRCW040210K0FKED; JLCPCB P/N: C71617
R50 R51 = Res1: Resistor; MANUF P/N: CR0402JF0512G; JLCPCB P/N: C100665
U13 = DS3231MZ/V+: ±5ppm, I2C Real-Time Clock; MANUF P/N: DS3231MZ+TRL; MF: Analog Devices; SnapEDA_Link: https://www.snapeda.com/parts/DS3231MZ/V+/Analog+Devices/view-part/?ref=snap; Package: SOIC-8 Maxim; Value: *; MP: DS3231MZ/V+; Check_prices: https://www.snapeda.com/parts/DS3231MZ/V+/Analog+Devices/view-part/?ref=eda; JLCPCB P/N: C107410

## Sheet Control_Module_IO.SchDoc: Módulo de Control - Entradas/Salidas
size A4; Author: Martin C.A. Yunis; CompanyName: Sistema de Control de Acceso; Revision: V1; SheetNumber: 7; SheetTotal: 7
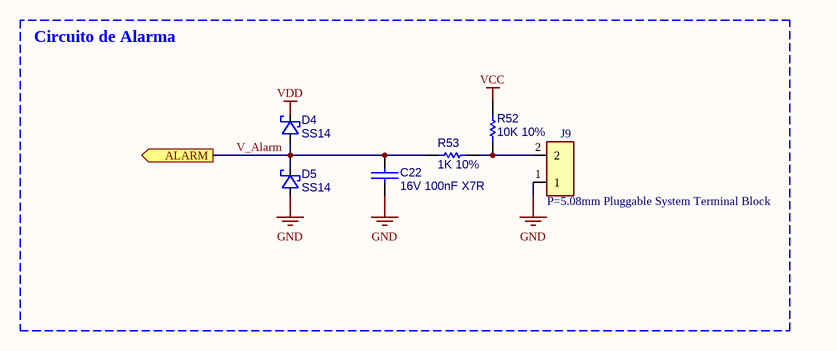
[diagram p6: Control_Module_IO.SchDoc]

### Parts
C22  16V 100nF X7R  [CAP0402]
D4  SS14  [D_SMA]
D5  SS14  [D_SMA]
J9  P=5.08mm Pluggable System Terminal Block  [TerminalBlock_1x2_P5mm]
R52  10K 10%  [RES0402]
R53  1K 10%  [RES0402]

### Blocks framed on the sheet
Circuito de Alarma: C22 D4 D5 J9 R52 R53

### Ports
ALARM (out, see Control_Module_MAIN[3A], Control_Module_CPU[1B])

### Nets
GND: C22.2 D5.1(A) J9.1
VCC: R52.1
VDD: D4.2(K)
V_Alarm: C22.1 D4.1(A) D5.2(K) R53.1 ; port ALARM
NetJ9_2: J9.2 R52.2 R53.2

### Notes on the sheet
- Title:
- Size:
- Author:
- A4
- Sheet
- of
- Revision:
- File:
- Date:

### Library data of the parts
C22 = CAP: as C1 on sheet Control_Module_ETH; JLCPCB P/N: C1525
D4 D5 = DIODO_SH: Diode Shottky; MANUF P/N: SS14; JLCPCB P/N: C2480
J9 = CONN_2P: Alarm Connector; MANUF P/N: WJ2EDGRC-5.08-2P; JLCPCB P/N: C3697,C8414; JLCPCB P/N 2: C8414
R52 = Res1: Resistor; MANUF P/N: CRCW040210K0FKED; JLCPCB P/N: C71617
R53 = Res1: Resistor; MANUF P/N: CRCW04021K00FKED; JLCPCB P/N: C71623

## Nets that join several sheets
GND: Control_Module_ETH (42 pins), Control_Module_CPU (21 pins), Control_Module_RS485 (20 pins), Control_Module_PSU (8 pins), Control_Module_PER (7 pins), Control_Module_IO (C22.2 D5.1 J9.1)
VCC: Control_Module_ETH (FB1.2 R5.2), Control_Module_CPU (D2.2), Control_Module_RS485 (12 pins), Control_Module_PSU (C18.1 D1.2 R45.1 U12.3), Control_Module_IO (R52.1)
VDD: Control_Module_ETH (14 pins), Control_Module_CPU (7 pins), Control_Module_RS485 (6 pins), Control_Module_PSU (6 pins), Control_Module_PER (8 pins), Control_Module_IO (D4.2)
CD: Control_Module_CPU (U6.17), Control_Module_PER (J8.CD R49.2)
CS_SD: Control_Module_CPU (U6.27), Control_Module_PER (J8.P2 R48.2)
INJ1: Control_Module_CPU (U6.18), Control_Module_RS485 (R39.2 U10.4)
INJ2: Control_Module_CPU (U6.19), Control_Module_RS485 (R40.2 U11.4)
INJ3: Control_Module_CPU (U6.20), Control_Module_RS485 (R31.2 U8.4)
INJ4: Control_Module_CPU (U6.21), Control_Module_RS485 (R32.2 U9.4)
MISO: Control_Module_CPU (U6.7), Control_Module_PER (J8.P7)
MOSI: Control_Module_CPU (U6.9), Control_Module_PER (J8.P3)
RX0: Control_Module_CPU (J5.3 U6.24), Control_Module_RS485 (U7.1)
RX1: Control_Module_ETH (U4.27), Control_Module_CPU (U6.4)
SCK: Control_Module_CPU (U6.6), Control_Module_PER (J8.P5)
SCL: Control_Module_CPU (U6.11), Control_Module_PER (R51.2 U13.8)
SDA: Control_Module_CPU (U6.12), Control_Module_PER (R50.2 U13.7)
TX0: Control_Module_CPU (J5.2 U6.25), Control_Module_RS485 (U7.4)
TX1: Control_Module_ETH (U4.23), Control_Module_CPU (U6.5)
TXE: Control_Module_CPU (U6.26), Control_Module_RS485 (R26.1 R41.1 U7.3)
V_Alarm: Control_Module_CPU (U6.8), Control_Module_IO (C22.1 D4.1 D5.2 R53.1)